# EAGLE schematic HC-SR04_Middle-Man_v9 (EAGLE 9.7.0)
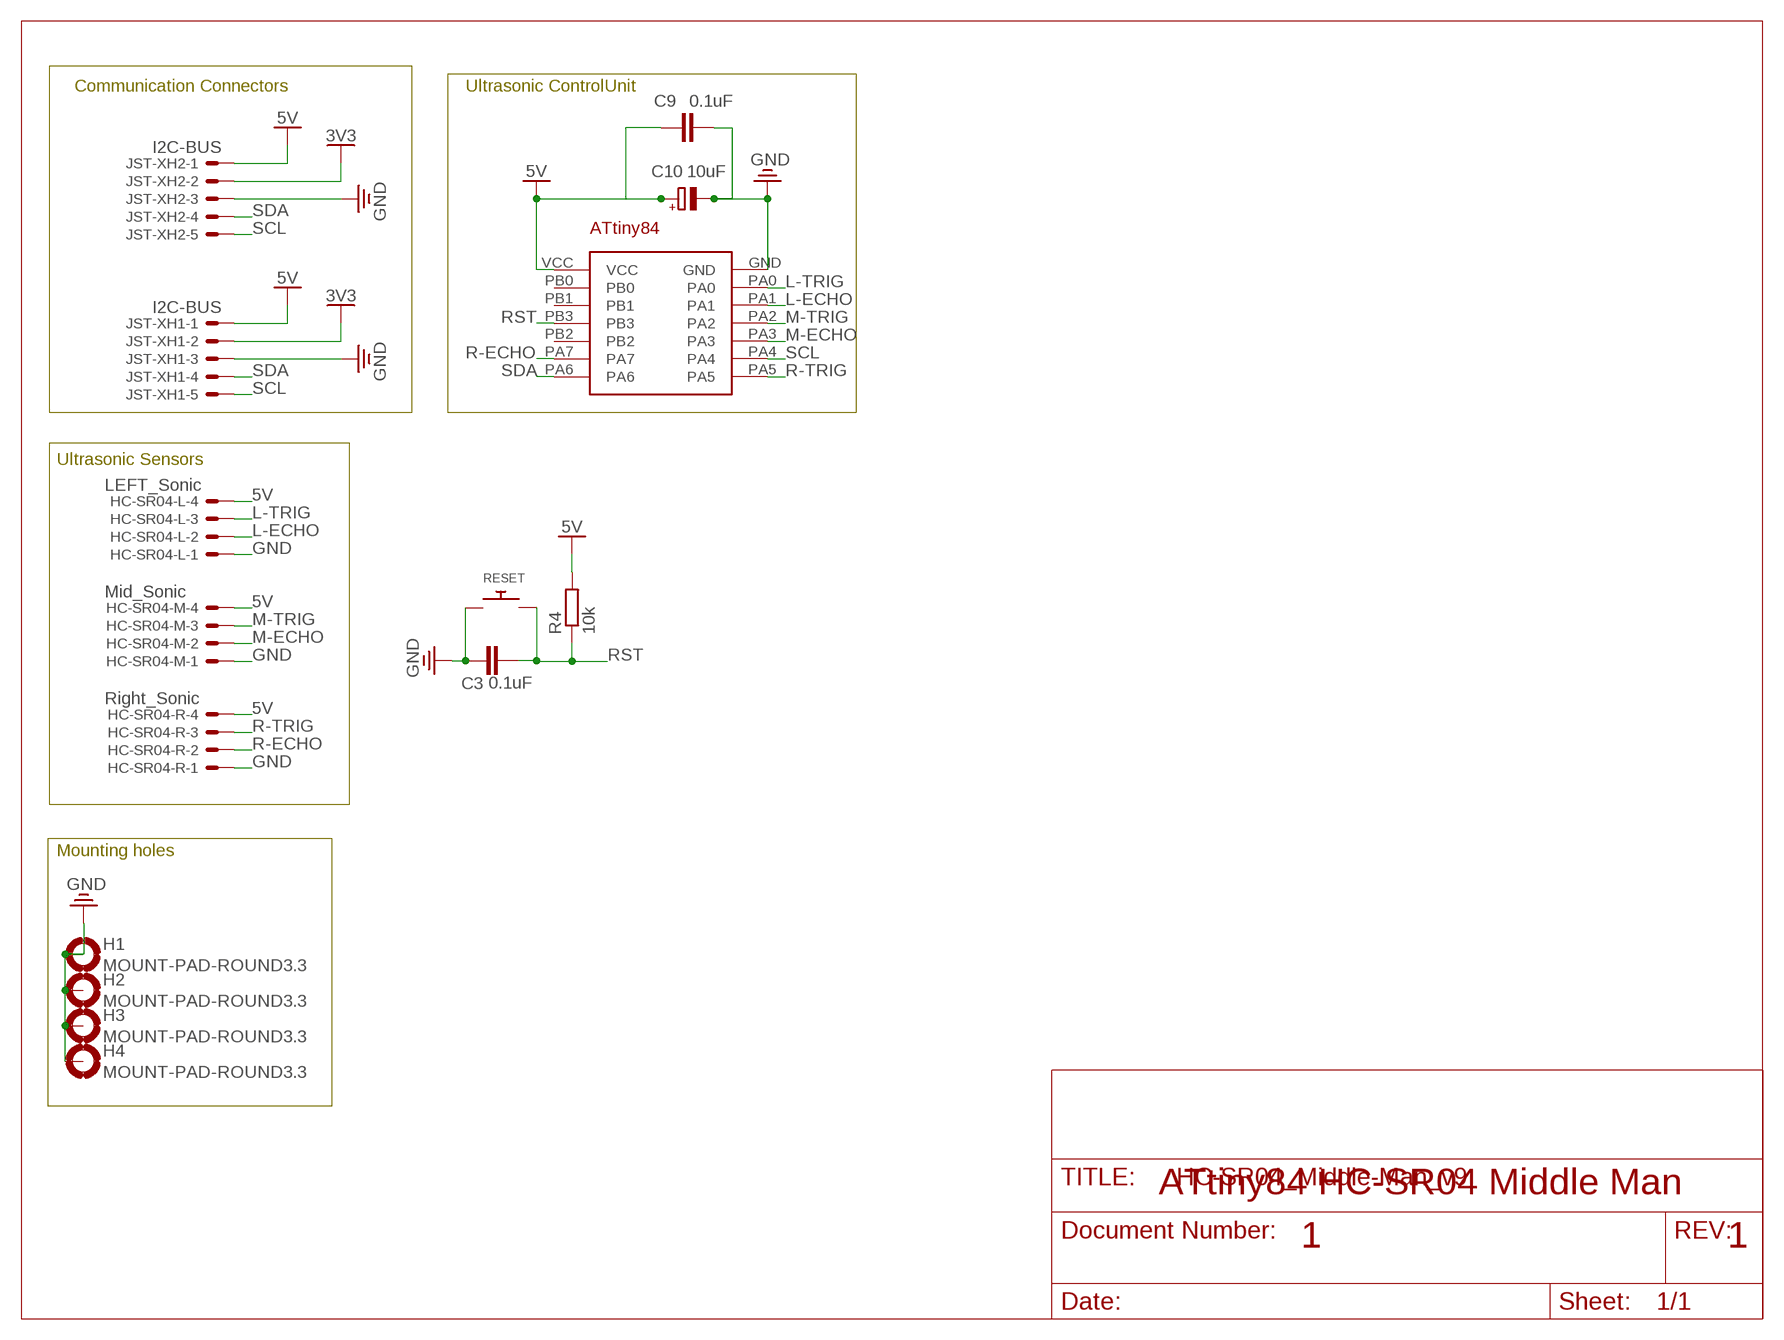
[diagram p0: schematic, sheet 1]

## Parts
C3  0.1uF  C-EU025-030X050  [C025-030X050]
C9  0.1uF  C-EU025-025X050  [C025-025X050]
C10  10uF  CPOL-EUE5-10.5  [E5-10,5]
H1  MOUNT-PAD-ROUND3.3  [3,3-PAD]
H2  MOUNT-PAD-ROUND3.3  [3,3-PAD]
H3  MOUNT-PAD-ROUND3.3  [3,3-PAD]
H4  MOUNT-PAD-ROUND3.3  [3,3-PAD]
HC-SR04-L  LEFT_Sonic  JST-XH-04-PIN-LONG-PAD  [JST-XH-04-PACKAGE-LONG-PAD]
HC-SR04-M  Mid_Sonic  JST-XH-04-PIN-LONG-PAD  [JST-XH-04-PACKAGE-LONG-PAD]
HC-SR04-R  Right_Sonic  JST-XH-04-PIN-LONG-PAD  [JST-XH-04-PACKAGE-LONG-PAD]
JST-XH1  I2C-BUS  JST-XH-05-PIN-LONG-PAD  [JST-XH-05-PACKAGE-LONG-PAD]
JST-XH2  I2C-BUS  JST-XH-05-PIN-LONG-PAD  [JST-XH-05-PACKAGE-LONG-PAD]
R4  10k  R-EU_0204/7  [0204/7]
RESET  SWITCH_PUSHBUTTONEVQ-PE  [TACT_PANA-EVQ]
U$3  ATTINY84DIP  [ATTINY84(DIP)]

## Nets
3V3: JST-XH1.2 JST-XH2.2
5V: C9.1 C10.+ HC-SR04-L.4 HC-SR04-M.4 HC-SR04-R.4 JST-XH1.1 JST-XH2.1 R4.2 U$3.VCC
GND: C3.1 C9.2 C10.- H1.B3,3(MOUNT) H2.B3,3(MOUNT) H3.B3,3(MOUNT) H4.B3,3(MOUNT) HC-SR04-L.1 HC-SR04-M.1 HC-SR04-R.1 JST-XH1.3 JST-XH2.3 RESET.P$1 U$3.GND
L-ECHO: HC-SR04-L.2 U$3.PA1
L-TRIG: HC-SR04-L.3 U$3.PA0
M-ECHO: HC-SR04-M.2 U$3.PA3
M-TRIG: HC-SR04-M.3 U$3.PA2
R-ECHO: HC-SR04-R.2 U$3.PA7
R-TRIG: HC-SR04-R.3 U$3.PA5
RST: C3.2 R4.1 RESET.P$2 U$3.PB3
SCL: JST-XH1.5 JST-XH2.5 U$3.PA4
SDA: JST-XH1.4 JST-XH2.4 U$3.PA6
Unconnected: U$3.PB0 U$3.PB1 U$3.PB2

## Notes on the sheet
- Communication Connectors | Ultrasonic ControlUnit
- Ultrasonic Sensors
- Mounting holes
- ATtiny84 HC-SR04 Middle Man
- 1 | 1

## Library data of the parts
C3 C9 = rcl:C-EU: CAPACITOR, European symbol; SPICEPREFIX: C
C10 = rcl:CPOL-EU: POLARIZED CAPACITOR, European symbol; SPICEPREFIX: C
H1-H4 = holes:MOUNT-PAD-ROUND: MOUNTING PAD, round
HC-SR04-L HC-SR04-M HC-SR04-R = Rembrandt Electronics - JST XH Connectors v1-0:JST-XH-04-PIN: JST XH Connector 2 Pin Wire to board connector. Pitch: 2,54 mm, (0.100") Number of pins: 4 Created by Rembrandt Electronics www.rembrandtelectronics.com
JST-XH1 JST-XH2 = Rembrandt Electronics - JST XH Connectors v1-0:JST-XH-05-PIN: JST XH Connector 2 Pin Wire to board connector. Pitch: 2,54 mm, (0.100") Number of pins: 5 Created by Rembrandt Electronics www.rembrandtelectronics.com
R4 = rcl:R-EU_: RESISTOR, European symbol; SPICEPREFIX: R
RESET = adafruit:SWITCH_PUSHBUTTON: Buttons SOFTTOUCHSMD_SJ - Soft touch temporary push button (Super Junk Akihabara) Compatible with SKPMANE010 [Mouser: 688-SKPMAN] C&K_KSS = Digikey: KSS221GLFS
U$3 = RobotMower_Eagle_Library:ATTINY84